# EAGLE schematic telemetry-shorter (EAGLE 7.7.0)
COMPANY: ADAFRUIT INDUSTRIES; DRAWN: KTOWN; REV: B

## Sheet 1 of 2
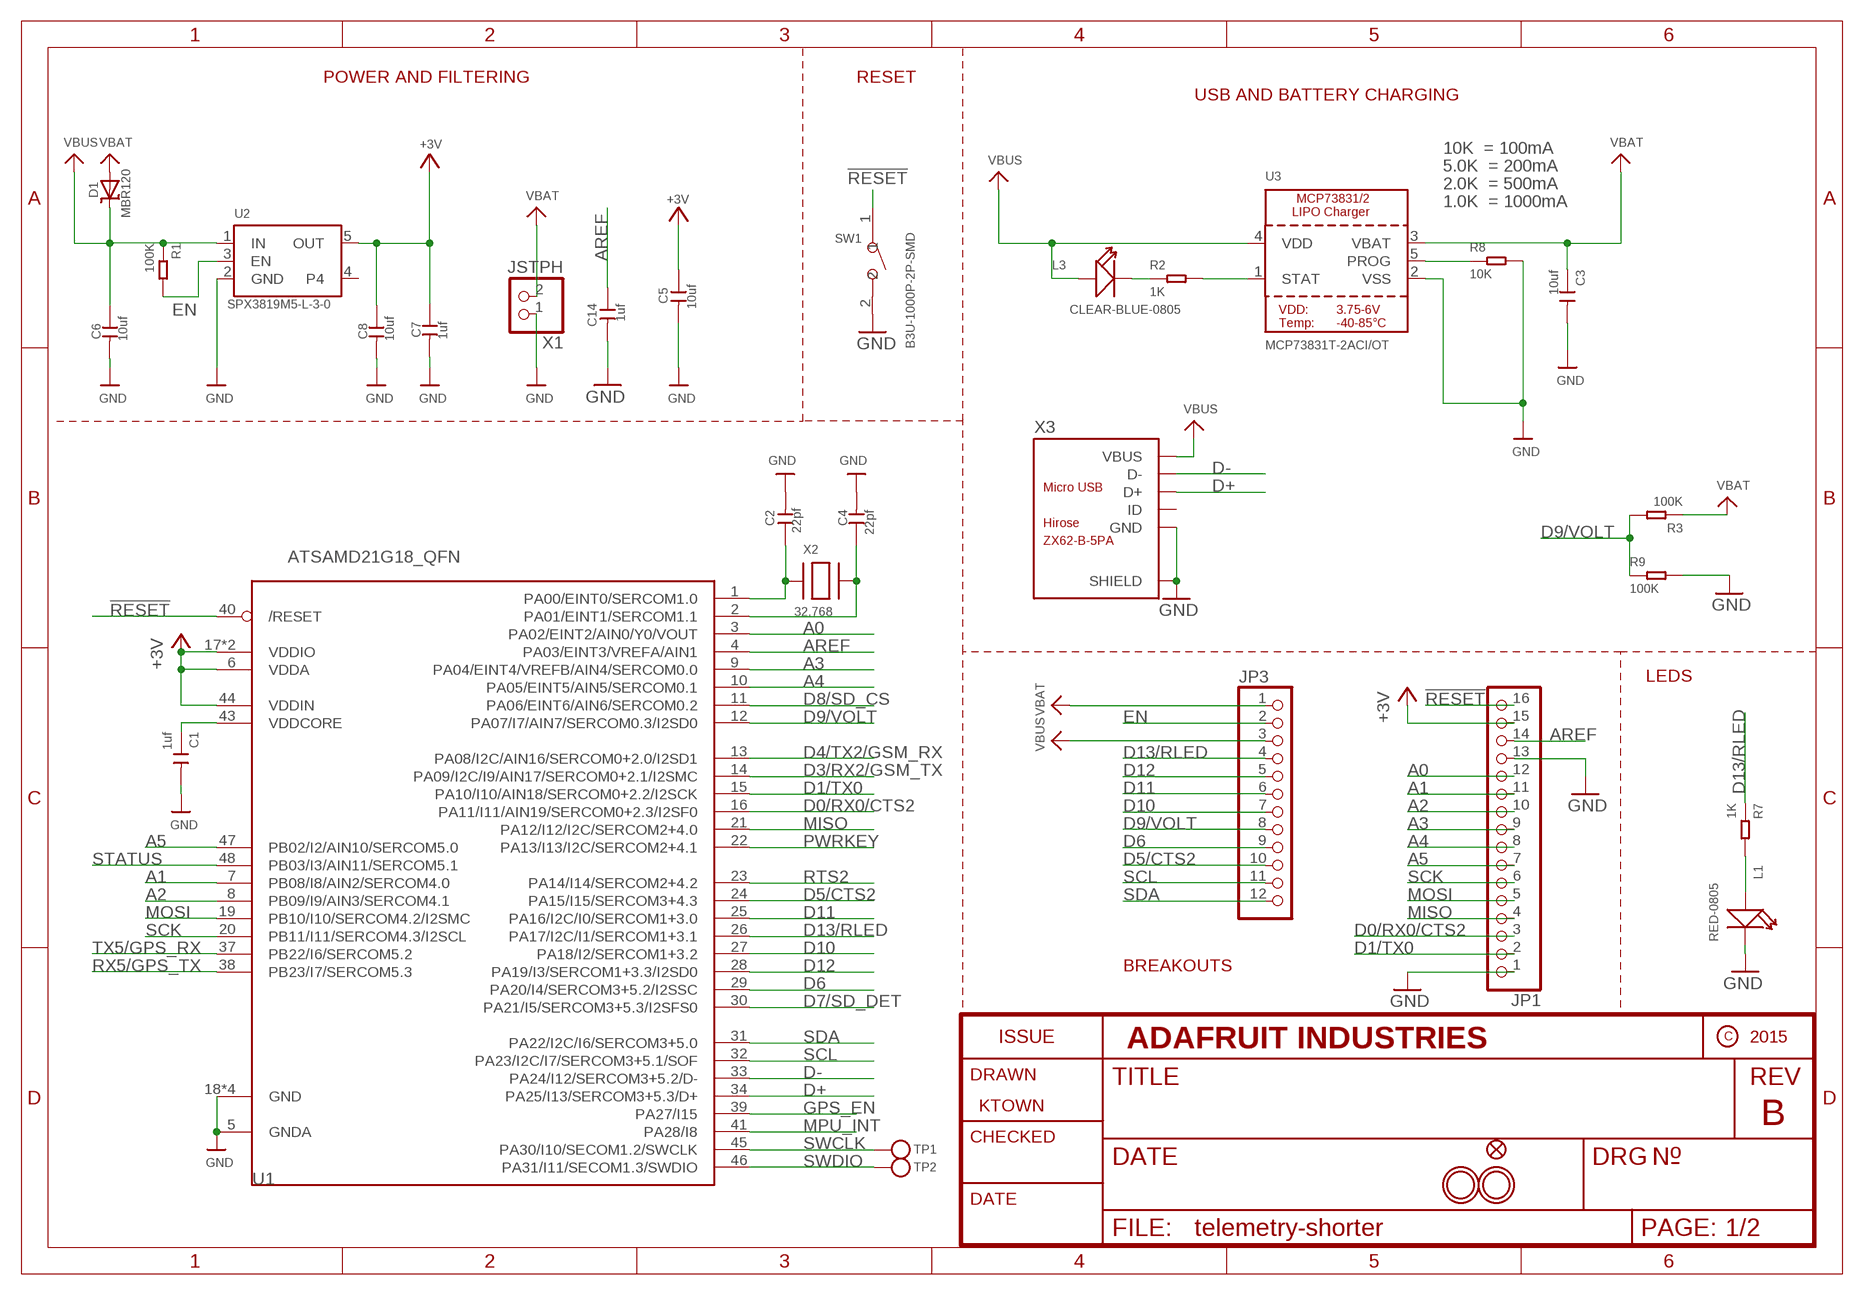
[diagram p0: schematic, sheet 1]

### Parts
C1  1uf  CERAMIC-1UF-25V-10%-X7R(0603)  [C0603]
C2  22pf  CERAMIC-22PF-50V-5%-NPO(0603)  [C0603]
C3  10uf  CERAMIC-10UF-10V-10%-X5R(0603)  [C0603]
C4  22pf  CERAMIC-22PF-50V-5%-NPO(0603)  [C0603]
C5  10uf  CERAMIC-10UF-10V-10%-X5R(0603)  [C0603]
C6  10uf  CERAMIC-10UF-10V-10%-X5R(0603)  [C0603]
C7  1uf  CERAMIC-1UF-25V-10%-X7R(0603)  [C0603]
C8  10uf  CERAMIC-10UF-10V-10%-X5R(0603)  [C0603]
C14  1uf  CERAMIC-1UF-25V-10%-X7R(0603)  [C0603]
D1  MBR120  DIODE-SCHOTTKYSOD-123  [SOD-123]
JP1  HEADER-1X16ROUND  [1X16_ROUND]
JP3  HEADER-1X12  [1X12_ROUND]
L1  RED-0805  SMD-LED-CLEAR-RED(0805)  [LED-0805]
L3  CLEAR-BLUE-0805  SMD-LED-CLEAR-BLUE(0805)  [LED-0805]
R1  100K  SMD-RES-100K-5%-1/10W(0603)  [R0603]
R2  1K  SMD-RES-1K-5%-1/10W(0603)  [R0603]
R3  100K  SMD-RES-100K-1%-1/10W(0603)  [R0603]
R7  1K  SMD-RES-1K-5%-1/10W(0603)  [R0603]
R8  10K  SMD-RES-10K-5%-1/10W(0603)  [R0603]
R9  100K  SMD-RES-100K-1%-1/10W(0603)  [R0603]
SW1  B3U-1000P-2P-SMD  SMD-BUTTON(2P-3.0X2.5X1.2+0.4MM)-B3U-1000P-2P-SMD  [SW2-2.6-3.0X2.5X1.2+0.4MM]
TP1  TESTPOINTROUND1.5MM  [TESTPOINT_ROUND_1.5MM]
TP2  TESTPOINTROUND1.5MM  [TESTPOINT_ROUND_1.5MM]
U1  ATSAMD21G18_QFN  ATSAMD21J_QFN  [TQFN48_7MM]
U2  SPX3819M5-L-3-0  VREG_SOT23-5  [SOT23-5]
U3  MCP73831T-2ACI/OT  MCP73831/2  [SOT23-5]
U$31  MOUNTINGHOLE2.5  [MOUNTINGHOLE_2.5_PLATED]
U$32  MOUNTINGHOLE2.5  [MOUNTINGHOLE_2.5_PLATED]
U$34  FIDUCIAL""  [FIDUCIAL_1MM]
X1  JSTPH  CON_JST_PH_2PIN  [JSTPH2]
X2  32.768  XTAL-3.2X1.5  [XTAL3215]
X3  ZX62-B-5PA  AO1SB141B1-067  [MICRO-USB5+6P-SMD-0.65-AB]

### Nets
!RESET: JP1.16 SW1.1 U1.40(/RESET)
+3V: C5.1 C7.1 C8.1 JP1.15 U1.6(VDDA) U1.17(VDDIO) U1.36(VDDIO) U1.44(VDDIN) U2.5(OUT) ; also sheet 2
A0: JP1.12 U1.3(PA02/EINT2/AIN0/Y0/VOUT)
A1: JP1.11 U1.7(PB08/I8/AIN2/SERCOM4.0)
A2: JP1.10 U1.8(PB09/I9/AIN3/SERCOM4.1)
A3: JP1.9 U1.9(PA04/EINT4/VREFB/AIN4/SERCOM0.0)
A4: JP1.8 U1.10(PA05/EINT5/AIN5/SERCOM0.1)
A5: JP1.7 U1.47(PB02/I2/AIN10/SERCOM5.0)
AREF: C14.1 JP1.14 U1.4(PA03/EINT3/VREFA/AIN1)
D0/RX0/CTS2: JP1.3 U1.16(PA11/I11/AIN19/SERCOM0+2.3/I2SF0)
D1/TX0: JP1.2 U1.15(PA10/I10/AIN18/SERCOM0+2.2/I2SCK)
D3/RX2/GSM_TX: U1.14(PA09/I2C/I9/AIN17/SERCOM0+2.1/I2SMC) ; also sheet 2
D4/TX2/GSM_RX: U1.13(PA08/I2C/AIN16/SERCOM0+2.0/I2SD1) ; also sheet 2
D5/CTS2: JP3.10 U1.24(PA15/I15/SERCOM3+4.3) ; also sheet 2
D6: JP3.9 U1.29(PA20/I4/SERCOM3+5.2/I2SSC)
D7/SD_DET: U1.30(PA21/I5/SERCOM3+5.3/I2SFS0) ; also sheet 2
D8/SD_CS: U1.11(PA06/EINT6/AIN6/SERCOM0.2) ; also sheet 2
D9/VOLT: JP3.8 R3.2 R9.1 U1.12(PA07/I7/AIN7/SERCOM0.3/I2SD0)
D10: JP3.7 U1.27(PA18/I2/SERCOM1+3.2)
D11: JP3.6 U1.25(PA16/I2C/I0/SERCOM1+3.0)
D12: JP3.5 U1.28(PA19/I3/SERCOM1+3.3/I2SD0)
D13/RLED: JP3.4 R7.1 U1.26(PA17/I2C/I1/SERCOM1+3.1)
D+: U1.34(PA25/I13/SERCOM3+5.3/D+) X3.3(D+)
D-: U1.33(PA24/I12/SERCOM3+5.2/D-) X3.2(D-)
EN: JP3.2 R1.2 U2.3(EN)
GND: C1.2 C2.2 C3.2 C4.2 C5.2 C6.2 C7.2 C8.2 C14.2 JP1.1 JP1.13 L1.- R8.2 R9.2 SW1.2 U1.5(GNDA) U1.18(GND) U1.35(GND) U1.42(GND) U1.THERMAL(GND) U2.2(GND) U3.2(VSS) X1.1 X3.5(GND) X3.P1(SHIELD) X3.P2(SHIELD) X3.P3(SHIELD) X3.P4(SHIELD) X3.P5(SHIELD) X3.P6(SHIELD) ; also sheet 2
GPS_EN: U1.39(PA27/I15) ; also sheet 2
MISO: JP1.4 U1.21(PA12/I12/I2C/SERCOM2+4.0) ; also sheet 2
MOSI: JP1.5 U1.19(PB10/I10/SERCOM4.2/I2SMC) ; also sheet 2
MPU_INT: U1.41(PA28/I8) ; also sheet 2
N$1: L3.- R2.1
N$3: R2.2 U3.1(STAT)
N$4: R8.1 U3.5(PROG)
N$5: C2.1 U1.1(PA00/EINT0/SERCOM1.0) X2.P$1
N$7: C4.1 U1.2(PA01/EINT1/SERCOM1.1) X2.P$2
N$8: L1.+ R7.2
PWRKEY: U1.22(PA13/I13/I2C/SERCOM2+4.1) ; also sheet 2
RTS2: U1.23(PA14/I14/SERCOM2+4.2) ; also sheet 2
RX5/GPS_TX: U1.38(PB23/I7/SERCOM5.3) ; also sheet 2
SCK: JP1.6 U1.20(PB11/I11/SERCOM4.3/I2SCL) ; also sheet 2
SCL: JP3.11 U1.32(PA23/I2C/I7/SERCOM3+5.1/SOF) ; also sheet 2
SDA: JP3.12 U1.31(PA22/I2C/I6/SERCOM3+5.0) ; also sheet 2
STATUS: U1.48(PB03/I3/AIN11/SERCOM5.1) ; also sheet 2
SWCLK: TP1.P$1 U1.45(PA30/I10/SECOM1.2/SWCLK)
SWDIO: TP2.P$1 U1.46(PA31/I11/SECOM1.3/SWDIO)
TX5/GPS_RX: U1.37(PB22/I6/SERCOM5.2) ; also sheet 2
VBAT: C3.1 D1.A JP3.1 R3.1 U3.3(VBAT) X1.2 ; also sheet 2
VBUS: C6.1 D1.C JP3.3 L3.+ R1.1 U2.1(IN) U3.4(VDD) X3.1(VBUS)
VDDCORE: C1.1 U1.43(VDDCORE)
Unconnected: U2.4 X3.4(ID)

### Notes on the sheet
- POWER AND FILTERING | RESET
- USB AND BATTERY CHARGING
- 10K  = 100mA
- 5.0K  = 200mA
- 2.0K  = 500mA
- 1.0K  = 1000mA
- LEDS
- BREAKOUTS

## Sheet 2 of 2
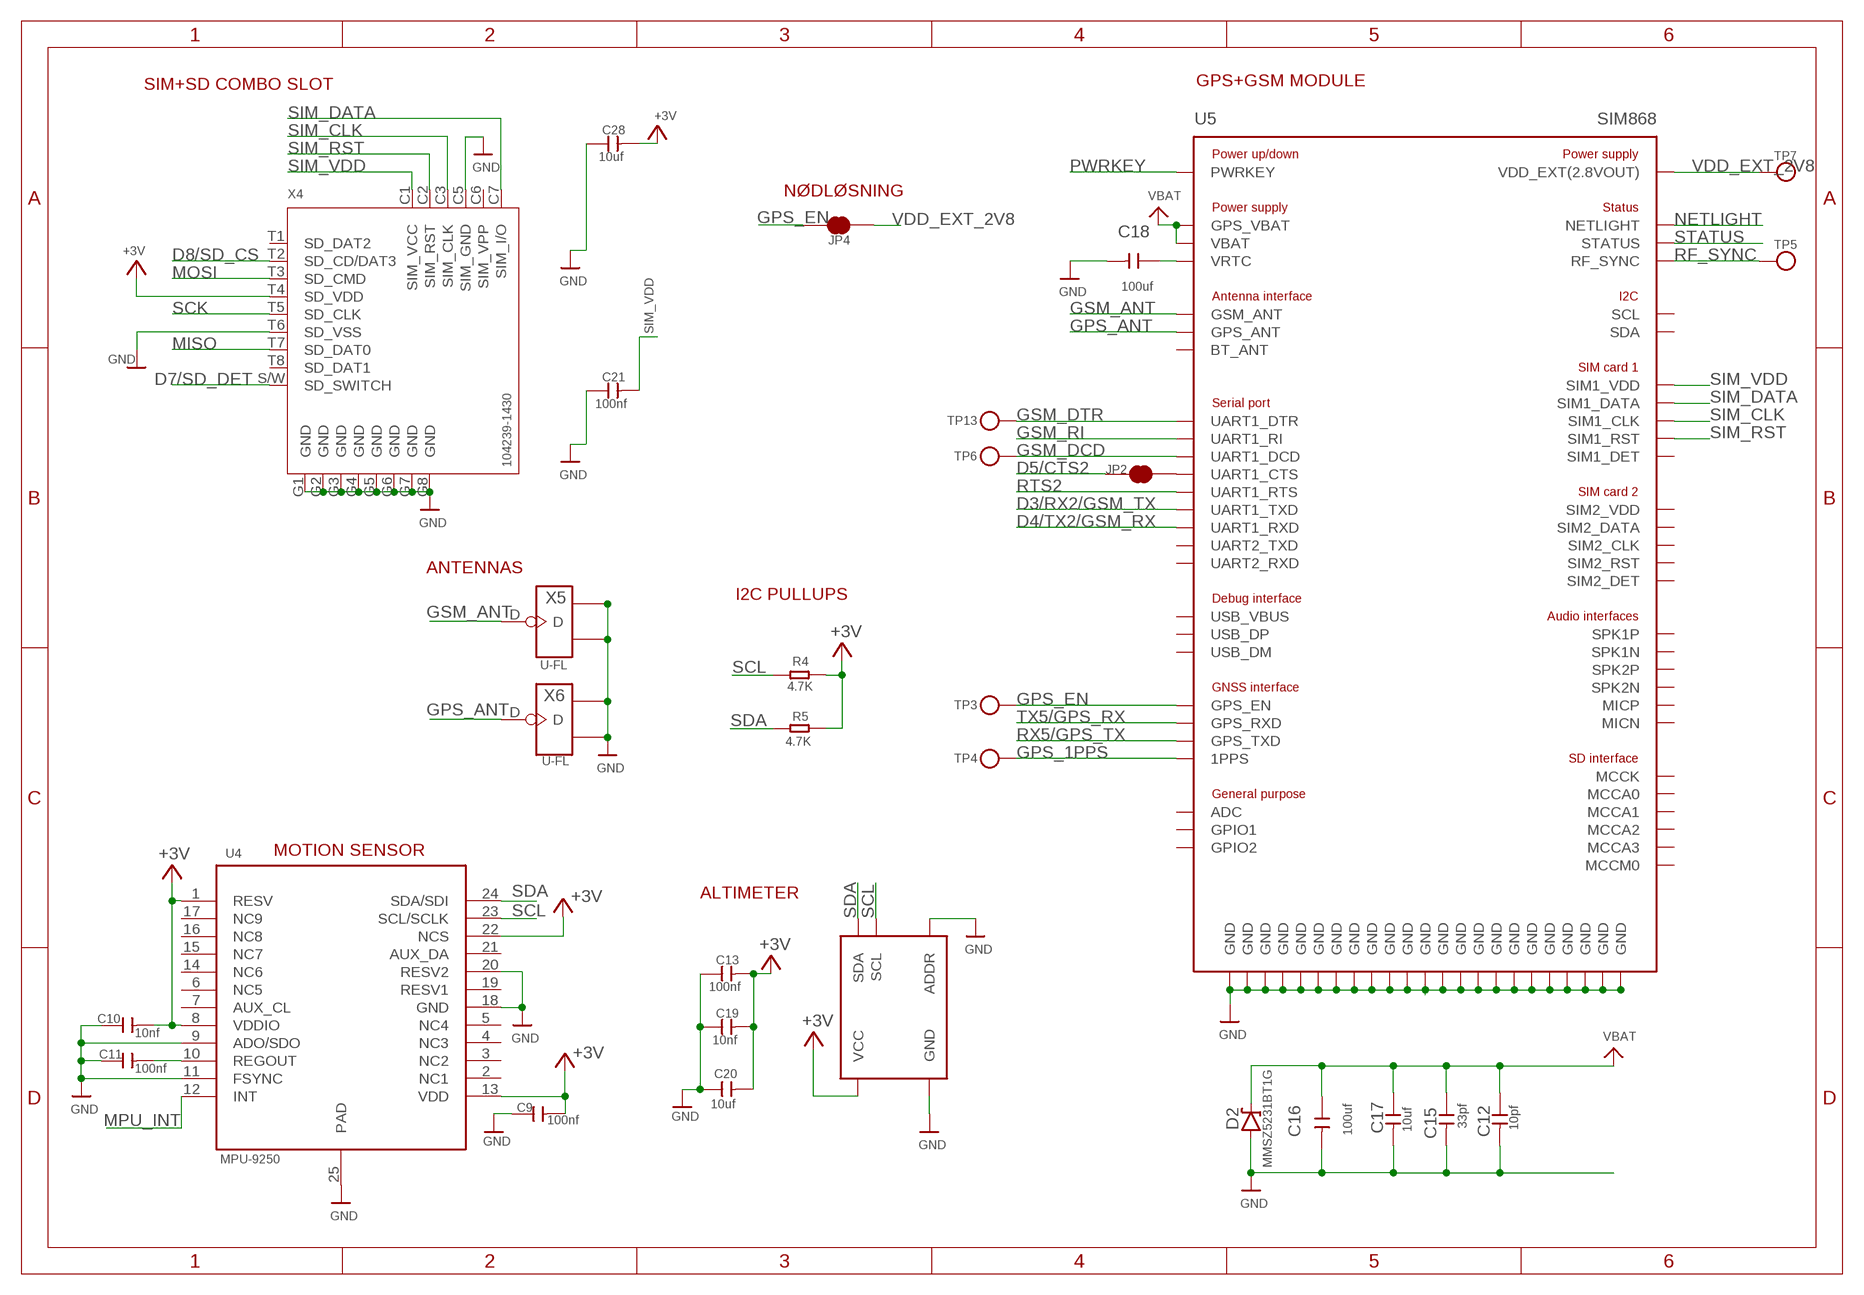
[diagram p1: schematic, sheet 2]

### Parts
C9  100nf  CERAMIC-100NF-50V-10%-X7R(0603)  [C0603]
C10  10nf  CERAMIC-10NF-50V-10%-X7R(0603)  [C0603]
C11  100nf  CERAMIC-100NF-50V-10%-X7R(0603)  [C0603]
C12  10pf  CERAMIC-10PF-50V-5%-NPO(0603)  [C0603]
C13  100nf  CERAMIC-100NF-50V-10%-X7R(0603)  [C0603]
C15  33pf  CERAMIC-33PF-50V-5%-NPO(0603)  [C0603]
C16  100uf  CERAMIC-100UF-6.3V-20%-X5R(1206)  [C1206]
C17  10uf  CERAMIC-10UF-10V-10%-X5R(0603)  [C0603]
C18  100uf  CERAMIC-100UF-6.3V-20%-X5R(1206)  [C1206]
C19  10nf  CERAMIC-10NF-50V-10%-X7R(0603)  [C0603]
C20  10uf  CERAMIC-10UF-10V-10%-X5R(0603)  [C0603]
C21  100nf  CERAMIC-100NF-50V-10%-X7R(0603)  [C0603]
C28  10uf  CERAMIC-10UF-10V-10%-X5R(0603)  [C0603]
D2  MMSZ5231BT1G  [SOD-123]
JP2  JUMPER-PAD-2-NC_BY_TRACE  [PAD-JUMPER-2-NC_BY_TRACE_YES_SILK]
JP4  JUMPER-PAD-2-NC_BY_TRACE  [PAD-JUMPER-2-NC_BY_TRACE_YES_SILK]
R4  4.7K  SMD-RES-4.7K-5%-1/10W(0603)  [R0603]
R5  4.7K  SMD-RES-4.7K-5%-1/10W(0603)  [R0603]
TP3  TESTPOINTROUND1.5MM  [TESTPOINT_ROUND_1.5MM]
TP4  TESTPOINTROUND1.5MM  [TESTPOINT_ROUND_1.5MM]
TP5  TESTPOINTROUND1.5MM  [TESTPOINT_ROUND_1.5MM]
TP6  TESTPOINTROUND1.5MM  [TESTPOINT_ROUND_1.5MM]
TP7  TESTPOINTROUND1.5MM  [TESTPOINT_ROUND_1.5MM]
TP13  TESTPOINTROUND1.5MM  [TESTPOINT_ROUND_1.5MM]
U4  MPU-9250  [LEAD-QFN24]
U5  SIM868  [SIM868]
U6  BMP280  [LGA-8]
X4  104239-1430  MOLEX-SD+SIM-104239  [MOLEX-SD+SIM-104239]
X5  U-FL  ANTENNA-CONN-U-FL(3P)  [U-FL3P-SMD-2.6X2.6X1.0MM]
X6  U-FL  ANTENNA-CONN-U-FL(3P)  [U-FL3P-SMD-2.6X2.6X1.0MM]

### Nets
+3V: C9.2 C10.2 C13.2 C19.2 C20.2 C28.2 R4.2 R5.2 U4.1(RESV) U4.8(VDDIO) U4.13(VDD) U4.22(NCS) U6.P2(VCC) U6.P6(VCC) U6.P8(VCC) X4.T4(SD_VDD) ; also sheet 1
D3/RX2/GSM_TX: U5.1_(UART1_TXD) ; also sheet 1
D4/TX2/GSM_RX: U5.2_(UART1_RXD) ; also sheet 1
D5/CTS2: JP2.1 ; also sheet 1
D7/SD_DET: X4.S/W(SD_SWITCH) ; also sheet 1
D8/SD_CS: X4.T2(SD_CD/DAT3) ; also sheet 1
GND: C9.1 C10.1 C11.1 C12.2 C13.1 C15.2 C16.2 C17.2 C18.2 C19.1 C20.1 C21.1 C28.1 D2.A U4.9(ADO/SDO) U4.11(FSYNC) U4.18(GND) U4.20(RESV2) U4.25(PAD) U5.8_(GND) U5.13_(GND) U5.19_(GND) U5.21_(GND) U5.27_(GND) U5.30_(GND) U5.31_(GND) U5.33_(GND) U5.36_(GND) U5.37_(GND) U5.45_(GND) U5.63_(GND) U5.66_(GND) U5.67_(GND) U5.69_(GND) U5.70_(GND) U5.71_(GND) U5.72_(GND) U5.73_(GND) U5.74_(GND) U5.75_(GND) U5.76_(GND) U5.77_(GND) U6.P1(GND) U6.P5(ADDR) U6.P7(GND) X4.C5(SIM_GND) X4.G1(GND) X4.G2(GND) X4.G3(GND) X4.G4(GND) X4.G5(GND) X4.G6(GND) X4.G7(GND) X4.G8(GND) X4.T6(SD_VSS) X5.GND1 X5.GND2 X6.GND1 X6.GND2 ; also sheet 1
GPS_1PPS: TP4.P$1 U5.60_(1PPS)
GPS_ANT: U5.68_(GPS_ANT) X6.D
GPS_EN: JP4.1 TP3.P$1 U5.59_(GPS_EN) ; also sheet 1
GSM_ANT: U5.32_(GSM_ANT) X5.D
GSM_DCD: TP6.P$1 U5.5_(UART1_DCD)
GSM_DTR: TP13.P$1 U5.6_(UART1_DTR)
GSM_RI: U5.7_(UART1_RI)
MISO: X4.T7(SD_DAT0) ; also sheet 1
MOSI: X4.T3(SD_CMD) ; also sheet 1
MPU_INT: U4.12(INT) ; also sheet 1
N$6: JP2.2 U5.4_(UART1_CTS)
N$23: C11.2 U4.10(REGOUT)
N$29: C18.1 U5.28_(VRTC)
NETLIGHT: U5.41_(NETLIGHT)
PWRKEY: U5.39_(PWRKEY) ; also sheet 1
RF_SYNC: TP5.P$1 U5.29_(RF_SYNC)
RTS2: U5.3_(UART1_RTS) ; also sheet 1
RX5/GPS_TX: U5.61_(GPS_TXD) ; also sheet 1
SCK: X4.T5(SD_CLK) ; also sheet 1
SCL: R4.1 U4.23(SCL/SCLK) U6.P4(SCL) ; also sheet 1
SDA: R5.1 U4.24(SDA/SDI) U6.P3(SDA) ; also sheet 1
SIM_CLK: U5.16_(SIM1_CLK) X4.C3(SIM_CLK)
SIM_DATA: U5.15_(SIM1_DATA) X4.C7(SIM_I/O)
SIM_RST: U5.17_(SIM1_RST) X4.C2(SIM_RST)
SIM_VDD: C21.2 U5.18_(SIM1_VDD) X4.C1(SIM_VCC)
STATUS: U5.42_(STATUS) ; also sheet 1
TX5/GPS_RX: U5.62_(GPS_RXD) ; also sheet 1
VBAT: C12.1 C15.1 C16.1 C17.1 D2.C U5.34_(GPS_VBAT) U5.35_(VBAT) ; also sheet 1
VDD_EXT_2V8: JP4.2 TP7.P$1 U5.40_(VDD_EXT(2.8VOUT))
Unconnected: U4.2(NC1) U4.3(NC2) U4.4(NC3) U4.5(NC4) U4.6(NC5) U4.7(AUX_CL) U4.14(NC6) U4.15(NC7) U4.16(NC8) U4.17(NC9) U4.19(RESV1) U4.21(AUX_DA) U5.9_(MICP) U5.10_(MICN) U5.11_(SPK1P) U5.12_(SPK1N) U5.14_(SIM1_DET) U5.20_(BT_ANT) U5.22_(UART2_TXD) U5.23_(UART2_RXD) U5.25_(USB_DP) U5.26_(USB_DM) U5.38_(ADC) U5.43_(SPK2N) U5.44_(SPK2P) U5.46_(MCCA3) U5.47_(MCCA2) U5.48_(MCCA1) U5.49_(MCCA0) U5.50_(MCCK) U5.51_(MCCM0) U5.52_(SIM2_DET) U5.53_(SIM2_DATA) U5.54_(SIM2_CLK) U5.55_(SIM2_RST) U5.57_(GPIO1) U5.58_(GPIO2) U5.64_(SDA) U5.65_(SCL) X4.C6(SIM_VPP) X4.T1(SD_DAT2) X4.T8(SD_DAT1)

### Notes on the sheet
- SIM+SD COMBO SLOT | GPS+GSM MODULE
- NØDLØSNING
- ANTENNAS
- I2C PULLUPS
- MOTION SENSOR
- ALTIMETER

## Power pins joined to a net without a drawn wire
SIM2_VDD: U5.56_(SIM2_VDD)
USB_VBUS: U5.24_(USB_VBUS)

## Library data of the parts
C1 C7 C14 = Seeed-Capacitor-2016:CERAMIC-1UF-25V-10%-X7R(0603): 302010139; MPN: CC0603KRX7R8BB105
C2 C4 = Seeed-Capacitor-2016:CERAMIC-22PF-50V-5%-NPO(0603): 302010143; MPN: CC0603JRNPO9BN220
C3 C5 C6 C8 C17 C20 C28 = Seeed-Capacitor-2016:CERAMIC-10UF-10V-10%-X5R(0603): 302010103; MPN: CC0603KRX5R6BB106
C9 C11 C13 C21 = Seeed-Capacitor-2016:CERAMIC-100NF-50V-10%-X7R(0603): 302010138; MPN: CC0603KRX7R9BB104
C10 C19 = Seeed-Capacitor-2016:CERAMIC-10NF-50V-10%-X7R(0603): 302010140; MPN: CC0603KRX7R9BB103
C12 = Seeed-Capacitor-2016:CERAMIC-10PF-50V-5%-NPO(0603): 302010097; MPN: CC0603JRNPO9BN100
C15 = Custom:CERAMIC-33PF-50V-5%-NPO(0603): not in Seeed OPL; MPN: CC0603JRNPO9BN330
C16 C18 = Seeed-Capacitor-2016:CERAMIC-100UF-6.3V-20%-X5R(1206): 302010183; MPN: GRM31CR60J107ME39L
D1 = microbuilder:DIODE-SCHOTTKY
D2 = Deegou-Diodes:MMSZ5231BT1G: DIODE ZENER 5.1V 500MW SOD123; MFR: ON SEMICONDUCTOR; MPN: MMSZ5231BT1G
JP1 = microbuilder:HEADER-1X16: PIN HEADER
JP2 JP4 = SparkFun-Passives:JUMPER-PAD-2-NC_BY_TRACE
JP3 = microbuilder:HEADER-1X12
L1 = Seeed-LED-2016:SMD-LED-CLEAR-RED(0805): 304090046; MPN: 17-215SURC/S530-A2/TR8
L3 = Seeed-LED-2016:SMD-LED-CLEAR-BLUE(0805): 304090061; MPN: EL-17-215/BHC-AN1P2/3T
R1 = Seeed-Resistor-2016:SMD-RES-100K-5%-1/10W(0603): 301010089; MPN: RC0603JR-07100KL; VALUE: 100K 1/10W
R2 R7 = Seeed-Resistor-2016:SMD-RES-1K-5%-1/10W(0603): 301010291; MPN: RC0603JR-071KL; VALUE: 1K 1/10W
R3 R9 = Seeed-Resistor-2016:SMD-RES-100K-1%-1/10W(0603): 301010196; MPN: RC0603FR-07100KL
R4 R5 = Seeed-Resistor-2016:SMD-RES-4.7K-5%-1/10W(0603): 301010290; MPN: RC0603JR-074K7L
R8 = Seeed-Resistor-2016:SMD-RES-10K-5%-1/10W(0603): 301010293; MPN: RC0603JR-0710KL; VALUE: 10K 1/10W
SW1 = Seeed-Switch-2016:SMD-BUTTON(2P-3.0X2.5X1.2+0.4MM): 311020047; MPN: B3U-1000P-2P-SMD
TP1-TP7 TP13 = microbuilder:TESTPOINT: Test Point Various test points for characterisation and PCB testing TESTPOINT_SMT - Compact Surface Mount Test Point [Digikey: 5016KTR-ND]
U1 = microbuilder:ATSAMD21J
U2 = microbuilder:VREG_SOT23-5: SOT23-5 Fixed Voltage Regulators Part Current Out V Out V In V Dropout θJA (°C/W) TJ (°C) Digikey Part No. ADP121 150mA 3.3V 3.4-5.5V 0.09V @ 150mA -- -- ADP121-AUJZ33R7CT-ND ADP121 150mA 3.0V 3.1-5.5V 0.09V @ 150mA -- -- ADP121-AUJZ30R7CT-ND ADP122 300mA 3.3V 3.4-5.5V 0.085V @ 300mA -- -- ADP122AUJZ-3.3-R7CT-ND ADP1712 300mA 3.3V 3.5-5.5V 0.17V @ 300mA -- -- ADP1712AUJZ-3.3-R7TR-ND AP7311 (Low Cost) 150mA 3.3V 3.5-6V 0.15V @ 150mA -- -- AP7311-33WG-7DICT-ND LD39015M18R 150mA 1.8V 1.9V-5.5V 0.08V @ 100mA -- -- 497-6977-1-ND LP2985A-33DBVR 150mA 3.3V 3.3-16V 0.28V @ 150mA 206 150 296-18479-1-ND MCP1824T-3302E/OT 300mA 3.3V 3.5V-6V 0.2V @ 300mA -- -- MCP1824T-3302E/OTCT-ND MIC5205-2.5YM5 TR 150mA 2.5V 2.7-16V 0.165V @ 150mA -- -- 576-1257-2-ND MIC5205-3.0YM5 TR 150mA 3.0V 3.2V-16V 0.165V @ 150mA -- -- 576-1258-2-ND MIC5205-3.3YM5 TR 150mA 3.3V 3.5V-16V 0.165V @ 150mA -- -- 576-1259-2-ND TPS780330220 150mA 3.3V+2.2V 3.6-5.5V 250mV Max -- -- 296-23332-1-ND TDA3663/N1,135 100mA 3.3V 3.5-45V 0.18V @ 50mA -- -- 568-5343-1-ND Max operating temp can be calculated using θJA, TJ (max junction temperature), and power in watts. Set the "Maximum Ambient Temperature" until it reaches TJ ("Max Junction Temperature"), which is the absolute limit for safe use of the regulator: Heat Sink Temperature Calculator <http://www.daycounter.com/Calculators/Heat-Sink-Temperature-Calculator.phtml> For example, With 12V source into a 3.3V LP2985 and a 30mA load, we are dissipating (12V-3.3V) * 0.03A = 0.261W. With a θJA of 206 °C/W, a TJ of 150°C, and 261mW we can safely use the chip without a heat sink up to 75°C (=147.1°C Junction Temperature).
U3 = microbuilder:MCP73831/2: MCP73831/2 LIPO Charger VDD: 3.75 - 6V Temp -40 - 85°C Programmable Charge Rate: 15-500mA NOTE: STAT is a tri-state logic output on the MCP73831 and an open-drain output on the MCP73832. SOT23-5 with 4.2V output and tri-state logic on STAT = MCP73831T-2ACI/OT
U4 = misc:MPU-9250
U5 = SIM868:SIM868
U6 = BMP280:BMP280: A 100nF capacitor is recommended between Vdd and GND, and also between Vddio and GND. Vdd & Vddio 3.3v I2C Address: ADDR -> Vddio = 0x77, ADDR -> GND = 0x76
U$31 U$32 = microbuilder:MOUNTINGHOLE: Mounting Hole For #2 screws (0.086"/2.18mm width, 0.094"/2.4mm hole) use 2.5mm; BOM: EXCLUDE
U$34 = microbuilder:FIDUCIAL: Fiducial Alignment Points Various fiducial points for machine vision alignment.; BOM: EXCLUDE
X1 = microbuilder:CON_JST_PH_2PIN: JST 2-Pin Right-Angle Connector PH-Series - 4UConnector: 17311 SH-Series - 4UConnector: 07278
X2 = adafruit2:XTAL: Low cost SMT crystals, no capacitors included http://www.ladyada.net/library/eagle
X3 = Deegou-Connectors:AO1SB141B1-067: MICR USB B SMD TH SHLL CONN RCPT; MFR: Generic; MPN: AO1SB141B1-067; SEEED: ZX62-B-5PA
X4 = SimSdCombo:MOLEX-SD+SIM-104239: microSD/Nano-SIM Combo Connector Molex - 1042391430 Description: microSD/Nano-SIM Combo Connector 2.05mm Height, Pull-Lever Eject, Normal Mount, With Detect Switch, 8-Circuit microSD* Card Type, 6-Circuit Nano-SIM Card Type; MPN: VSHO-21-3301; VALUE: VSHO-21-3301
X5 X6 = Seeed-Connector -2016:ANTENNA-CONN-U-FL(3P): 320110048